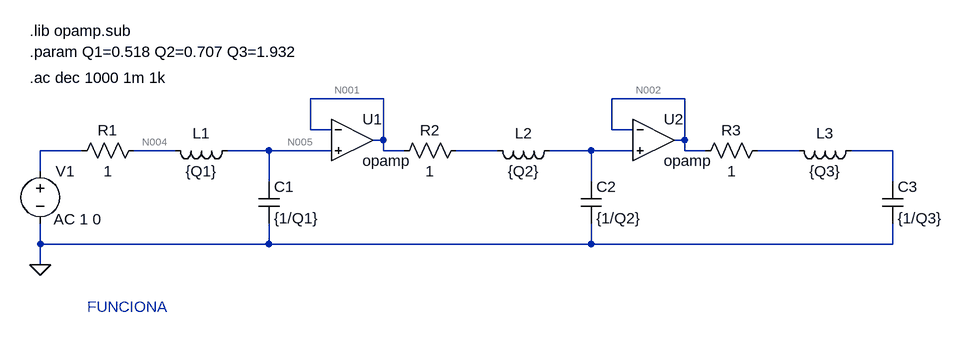
[diagram p0: schematic butterwoth_orden6_RLC.asc]
butterwoth_orden6_RLC.asc, the LTspice schematic file:
Version 4.1
SHEET 1 1492 680
WIRE 608 16 496 16
WIRE 1072 16 960 16
WIRE 496 64 496 16
WIRE 528 64 496 64
WIRE 960 64 960 16
WIRE 992 64 960 64
WIRE 608 80 608 16
WIRE 608 80 592 80
WIRE 1072 80 1072 16
WIRE 1072 80 1056 80
WIRE 144 96 80 96
WIRE 288 96 224 96
WIRE 432 96 368 96
WIRE 528 96 432 96
WIRE 608 96 608 80
WIRE 640 96 608 96
WIRE 784 96 720 96
WIRE 928 96 864 96
WIRE 992 96 928 96
WIRE 1072 96 1072 80
WIRE 1104 96 1072 96
WIRE 1248 96 1184 96
WIRE 1392 96 1328 96
WIRE 80 128 80 96
WIRE 432 144 432 96
WIRE 928 144 928 96
WIRE 1392 144 1392 96
WIRE 80 240 80 208
WIRE 432 240 432 208
WIRE 432 240 80 240
WIRE 928 240 928 208
WIRE 928 240 432 240
WIRE 1392 240 1392 208
WIRE 1392 240 928 240
WIRE 80 272 80 240
FLAG 80 272 0
SYMBOL res 240 80 R90
WINDOW 0 0 56 VBottom 2
WINDOW 3 32 56 VTop 2
SYMATTR InstName R1
SYMATTR Value 1
SYMBOL ind 384 80 R90
WINDOW 0 5 56 VBottom 2
WINDOW 3 32 56 VTop 2
SYMATTR InstName L1
SYMATTR Value {Q1}
SYMATTR SpiceLine Rser=1m
SYMBOL cap 416 144 R0
SYMATTR InstName C1
SYMATTR Value {1/Q1}
SYMBOL voltage 80 112 R0
WINDOW 123 21 90 Left 2
WINDOW 39 0 0 Left 0
SYMATTR Value2 AC 1 0
SYMATTR InstName V1
SYMATTR Value ""
SYMBOL res 736 80 R90
WINDOW 0 0 56 VBottom 2
WINDOW 3 32 56 VTop 2
SYMATTR InstName R2
SYMATTR Value 1
SYMBOL ind 880 80 R90
WINDOW 0 5 56 VBottom 2
WINDOW 3 32 56 VTop 2
SYMATTR InstName L2
SYMATTR Value {Q2}
SYMATTR SpiceLine Rser=1m
SYMBOL cap 912 144 R0
SYMATTR InstName C2
SYMATTR Value {1/Q2}
SYMBOL OpAmps\\opamp 560 16 R0
SYMATTR InstName U1
SYMBOL res 1200 80 R90
WINDOW 0 0 56 VBottom 2
WINDOW 3 32 56 VTop 2
SYMATTR InstName R3
SYMATTR Value 1
SYMBOL ind 1344 80 R90
WINDOW 0 5 56 VBottom 2
WINDOW 3 32 56 VTop 2
SYMATTR InstName L3
SYMATTR Value {Q3}
SYMATTR SpiceLine Rser=1m
SYMBOL cap 1376 144 R0
SYMATTR InstName C3
SYMATTR Value {1/Q3}
SYMBOL OpAmps\\opamp 1024 16 R0
SYMATTR InstName U2
TEXT 64 -16 Left 2 !.ac dec 1000 1m 1k
TEXT 64 -56 Left 2 !.param Q1=0.518 Q2=0.707 Q3=1.932
TEXT 64 -88 Left 2 !.lib opamp.sub
TEXT 152 336 Left 2 ;FUNCIONA

The netlist it stands for:
* butterwoth_orden6_RLC.asc
R1 N004 N003 1
L1 N005 N004 {Q1} Rser=1m
C1 N005 0 {1/Q1}
V1 N003 0 AC 1 0
R2 N006 N001 1
L2 N007 N006 {Q2} Rser=1m
C2 N007 0 {1/Q2}
X§U1 N001 N005 N001 opamp Aol=100K GBW=10Meg  ; pins invin noninvin out
R3 N008 N002 1
L3 N009 N008 {Q3} Rser=1m
C3 N009 0 {1/Q3}
X§U2 N002 N007 N002 opamp Aol=100K GBW=10Meg  ; pins invin noninvin out
.ac dec 1000 1m 1k
.param Q1=0.518 Q2=0.707 Q3=1.932
.lib opamp.sub
* FUNCIONA
.backanno
.end

* Results of the author's LTspice run, read from the files saved beside the schematic
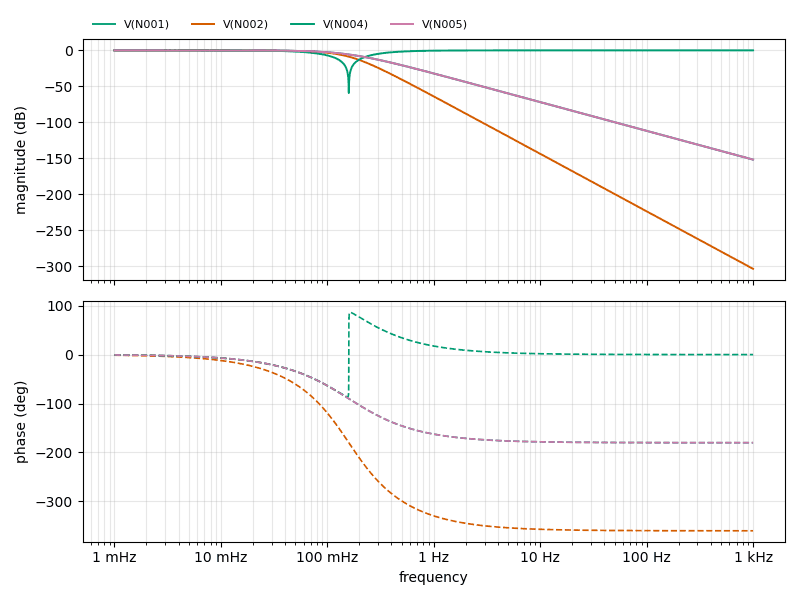
[diagram p1: AC Analysis of butterwoth_orden6_RLC.asc, plotted from the saved traces]
* AC Analysis, 1 run:
*   V(N001): -0.00 dB at 1 mHz, -151.93 dB at 1 kHz, peak -0.00 dB at 1 mHz, 3 dB below the peak at 107.5 mHz
*   V(N002): -0.00 dB at 1 mHz, -303.85 dB at 1 kHz, peak -0.00 dB at 1 mHz, 3 dB below the peak at 96.01 mHz
*   V(N004): -0.00 dB at 1 mHz, -0.00 dB at 1 kHz, peak -0.00 dB at 1 kHz, 3 dB below the peak at 375.1 mHz
*   V(N005): -0.00 dB at 1 mHz, -151.93 dB at 1 kHz, peak -0.00 dB at 1 mHz, 3 dB below the peak at 107.5 mHz